# Altium project Carte d'extension.PrjPcb
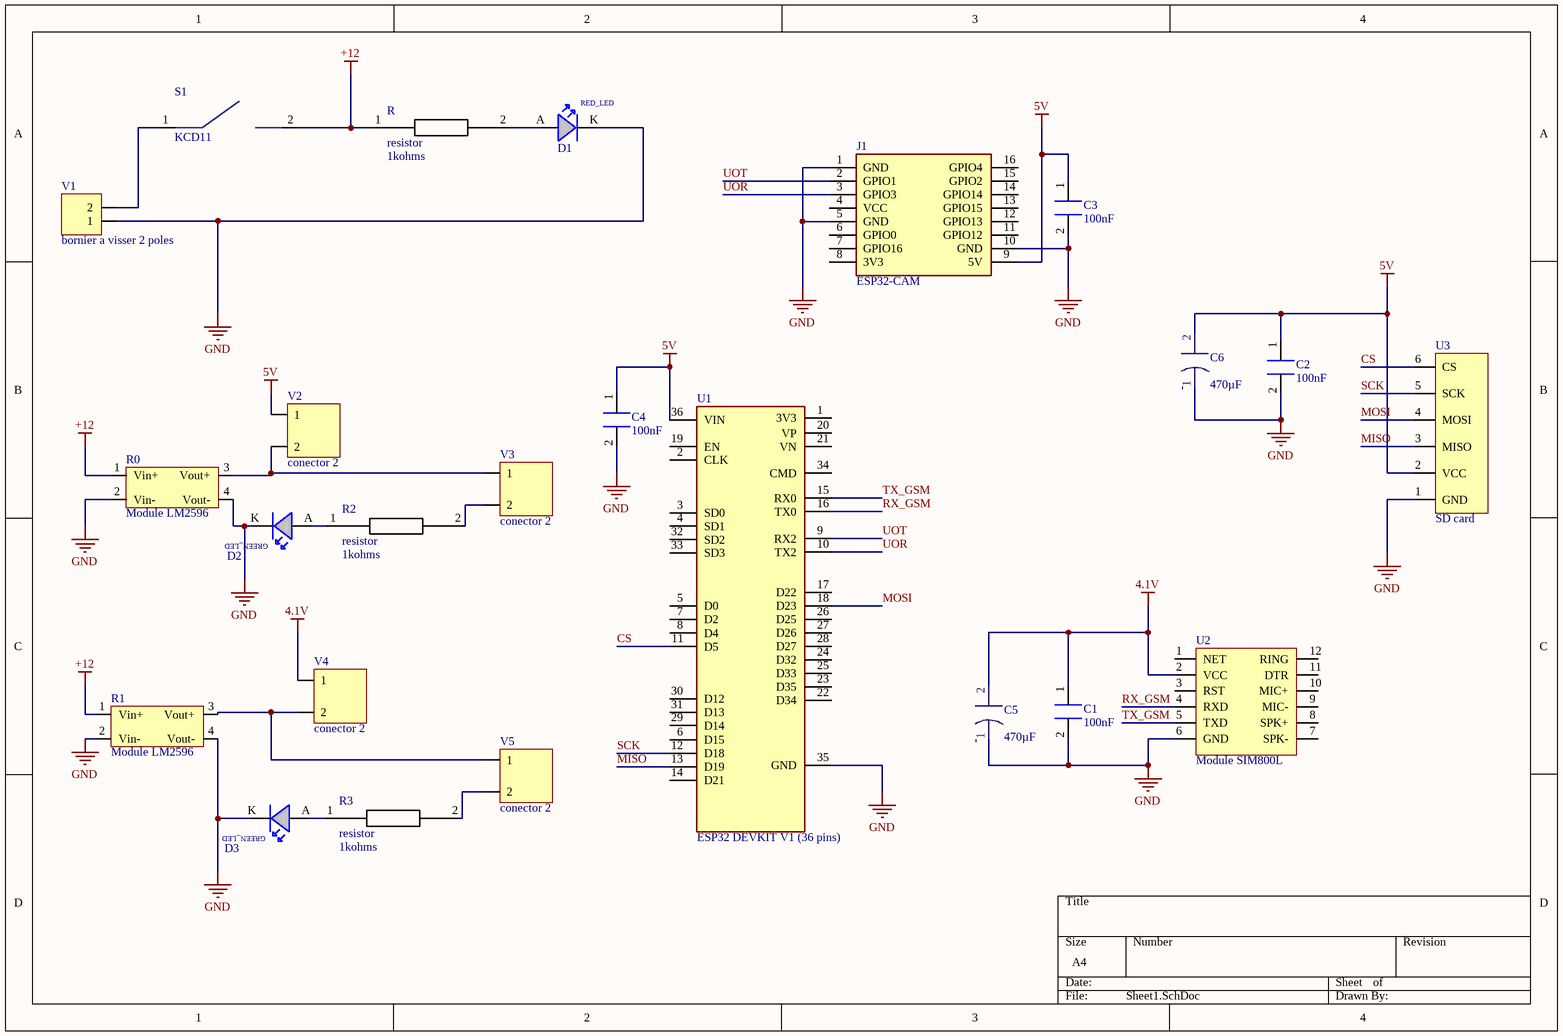
[diagram p0: Sheet1.SchDoc]
1 sheet, 24 parts. Net scope: global (net labels, ports and power ports of the same name join across sheets).
Board file: PCB1.PcbDoc

## Sheet Sheet1.SchDoc
size A4

### Parts
C1  Cap en uF ou nF: 100nF  [CAPACITOR]  (hidden comment: capacitor)
C2  Cap en uF ou nF: 100nF  [CAPACITOR]  (hidden comment: capacitor)
C3  Cap en uF ou nF: 100nF  [CAPACITOR]  (hidden comment: capacitor)
C4  Cap en uF ou nF: 100nF  [CAPACITOR]  (hidden comment: capacitor)
C5  value 470µF  [condensateur chimique 470f 16v -]  (hidden comment: condensateur chimique_470uF)
C6  value 470µF  [condensateur chimique 470f 16v -]  (hidden comment: condensateur chimique_470uF)
D1  LED_RED  [LED]  (value not drawn)
D2  LED_GREEN  [LED_GREEN]  (value not drawn)
D3  LED_GREEN  [LED_GREEN]  (value not drawn)
J1  ESP32-CAM  [ESP32-CAM]
R  resistor  R: 1kohms  [RESISTOR]
R0  Module LM2596  [Module LM2596]
R1  Module LM2596  [Module LM2596]
R2  resistor  R: 1kohms  [RESISTOR]
R3  resistor  R: 1kohms  [RESISTOR]
S1  KCD11  [PCBComponent_1]
U1  ESP32 DEVKIT V1 (36 pins)  [ESP32 DEVKIT V1 (36 pins)]
U2  Module SIM800L  [SIM800L]
U3  SD card  [SULLINS_PPTC061LFBN-RC - duplicate]
V1  bornier a visser 2 poles  [bornier a visser 2 poles]
V2  conector 2  [PCBComponent_1]
V3  conector 2  [PCBComponent_1]
V4  conector 2  [PCBComponent_1]
V5  conector 2  [PCBComponent_1]

### Nets
4.1V: C1.1 C5.2 U2.2(VCC) V4.1
5V: C2.1 C3.1 C4.1 C6.2 J1.9(5V) U1.36(VIN) U3.2(VCC) V2.1
+12: R.1 R0.1(Vin+) R1.1(Vin+) S1.2
GND: C1.2 C2.2 C3.2 C4.2 C5.1 C6.1 D1.K D2.K D3.K J1.1(GND) J1.5(GND) J1.10(GND) R0.2(Vin-) R0.4(Vout-) R1.2(Vin-) R1.4(Vout-) U1.35(GND) U2.6(GND) U3.1(GND) V1.1
CS: U1.11(D5) U3.6(CS)
MISO: U1.13(D19) U3.3(MISO)
MOSI: U1.18(D23) U3.4(MOSI)
RX_GSM: U1.16(TX0) U2.4(RXD)
SCK: U1.12(D18) U3.5(SCK)
TX_GSM: U1.15(RX0) U2.5(TXD)
UOR: J1.3(GPIO3) U1.10(TX2)
UOT: J1.2(GPIO1) U1.9(RX2)
NetD1_A: D1.A R.2
NetD2_A: D2.A R2.1
NetD3_A: D3.A R3.1
NetR0_3: R0.3(Vout+) V2.2 V3.1
NetR1_3: R1.3(Vout+) V4.2 V5.1
NetR2_2: R2.2 V3.2
NetR3_2: R3.2 V5.2
NetS1_1: S1.1 V1.2

Not connected (* = marked no-connect by the designer): J1 4(VCC) 6(GPIO0) 7(GPIO16) 8(3V3) 11(GPIO12) 12(GPIO13) 13(GPIO15) 14(GPIO14) 15(GPIO2) 16(GPIO4); U1 1(3V3) 2(CLK) 3(SD0) 4(SD1) 5(D0) 6(D15) 7(D2) 8(D4) 14(D21) 17(D22) 19(EN) 20(VP) 21(VN) 22(D34) 23(D35) 24(D32) 25(D33) 26(D25) 27(D26) 28(D27) 29(D14) 30(D12) 31(D13) 32(SD2) 33(SD3) 34(CMD); U2 1(NET) 3(RST) 7(SPK-) 8(SPK+) 9(MIC-) 10(MIC+) 11(DTR) 12(RING)

### Notes on the sheet
- (in symbol condensateur chimique_470uF) -
- (in symbol LED_GREEN) GREEN_LED
- (in symbol LED_RED) RED_LED

### Library data of the parts
J1 = ESP32-CAM: ESP32 ESP32 Transceiver; 802.11 a/b/g/n (Wi-Fi, WiFi, WLAN), BluetoothÂ® Smart 4.x Low Energy (BLE) Evaluation Board; MF: AI-Thinker; SnapEDA_Link: https://www.snapeda.com/parts/ESP32-CAM/AI-Thinker/view-part/?ref=snap; Package: None; Value: *; MP: ESP32-CAM; Check_prices: https://www.snapeda.com/parts/ESP32-CAM/AI-Thinker/view-part/?ref=eda
U1 = ESP32 DEVKIT V1 (36 pins): Dual core, Wi-Fi: 2.4 GHz up to 150 Mbits/s,BLE (Bluetooth Low Energy) and legacy Bluetooth, 32 bits, Up to 240 MHz; MF: Do it; MP: ESP32-DEVKIT-V1; SnapEDA_Link: https://www.snapeda.com/parts/ESP32-DEVKIT-V1/Do+it/view-part/?ref=snap; Package: None; Value: *; Check_prices: https://www.snapeda.com/parts/ESP32-DEVKIT-V1/Do+it/view-part/?ref=eda
U2 = SIM800L
U3 = SD card V2
V1 = bornier a visser 2 poles: Parameter 1: *